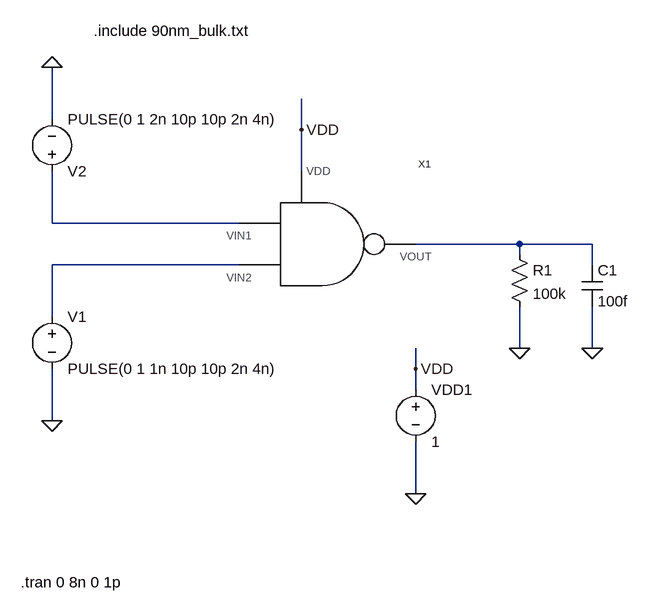
[diagram p0: schematic NAND_tb.asc]
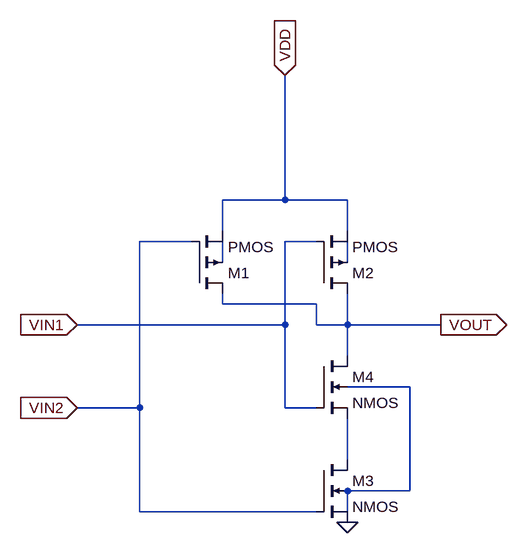
[diagram p1: sub-circuit nand.asc]
NAND_tb.asc, the LTspice schematic file:
Version 4
SHEET 1 880 680
WIRE -416 -352 -416 -432
WIRE -32 -336 -32 -384
WIRE -32 -272 -32 -336
WIRE -416 -192 -416 -272
WIRE -128 -192 -416 -192
WIRE 304 -160 144 -160
WIRE 416 -160 304 -160
WIRE 304 -144 304 -160
WIRE -128 -128 -416 -128
WIRE 416 -128 416 -160
WIRE -416 -48 -416 -128
WIRE 304 0 304 -64
WIRE 416 0 416 -64
WIRE 144 32 144 0
WIRE 144 64 144 32
WIRE -416 112 -416 32
WIRE 144 224 144 144
FLAG 144 224 0
FLAG 144 32 VDD
FLAG 304 0 0
FLAG 416 0 0
FLAG -32 -336 VDD
FLAG -416 112 0
FLAG -416 -432 0
SYMBOL voltage -416 -64 R0
WINDOW 123 0 0 Left 0
WINDOW 39 0 0 Left 0
SYMATTR InstName V1
SYMATTR Value PULSE(0 1 1n 10p 10p 2n 4n)
SYMBOL res 288 -160 R0
SYMATTR InstName R1
SYMATTR Value 100k
SYMBOL cap 400 -128 R0
SYMATTR InstName C1
SYMATTR Value 100f
SYMBOL voltage 144 48 R0
WINDOW 123 0 0 Left 0
WINDOW 39 0 0 Left 0
SYMATTR InstName VDD1
SYMATTR Value 1
SYMBOL NAND -16 -160 R0
SYMATTR InstName X1
SYMBOL voltage -416 -256 M180
WINDOW 123 0 0 Left 0
WINDOW 39 0 0 Left 0
SYMATTR InstName V2
SYMATTR Value PULSE(0 1 2n 10p 10p 2n 4n)
TEXT -352 -488 Left 2 !.include 90nm_bulk.txt
TEXT -464 360 Left 2 !.tran 0 8n 0 1p

nand.asc, the sub-circuit schematic file:
Version 4
SHEET 1 880 680
WIRE 32 -64 32 -256
WIRE 32 -64 -64 -64
WIRE 128 -64 32 -64
WIRE -64 -16 -64 -64
WIRE 128 -16 128 -64
WIRE -112 0 -192 0
WIRE 80 0 32 0
WIRE -64 32 -64 0
WIRE 128 32 128 0
WIRE -64 96 -64 80
WIRE 80 96 -64 96
WIRE 32 128 32 0
WIRE 32 128 -288 128
WIRE 80 128 80 96
WIRE 128 128 128 80
WIRE 128 128 80 128
WIRE 272 128 128 128
WIRE 128 176 128 128
WIRE 224 224 128 224
WIRE -192 256 -192 0
WIRE -192 256 -288 256
WIRE 32 256 32 128
WIRE 80 256 32 256
WIRE 128 336 128 272
WIRE 224 384 224 224
WIRE 224 384 128 384
WIRE -192 416 -192 256
WIRE 80 416 -192 416
WIRE 128 416 128 384
FLAG 128 432 0
FLAG -288 128 VIN1
IOPIN -288 128 In
FLAG -288 256 VIN2
IOPIN -288 256 In
FLAG 32 -256 VDD
IOPIN 32 -256 In
FLAG 272 128 VOUT
IOPIN 272 128 Out
SYMBOL pmos4 -112 80 M180
SYMATTR InstName M1
SYMATTR Value2 l=90n w=400n
SYMBOL pmos4 80 80 M180
SYMATTR InstName M2
SYMATTR Value2 l=90n w=400n
SYMBOL nmos4 80 336 R0
SYMATTR InstName M3
SYMATTR Value2 l=90n w=200n
SYMBOL nmos4 80 176 R0
SYMATTR InstName M4
SYMATTR Value2 l=90n w=200n

The netlist it stands for:
* NAND_tb.asc
V1 N003 0 PULSE(0 1 1n 10p 10p 2n 4n)
R1 N002 0 100k
C1 N002 0 100f
VDD1 VDD 0 1
XX1 VDD N001 N002 N003 nand
V2 N001 0 PULSE(0 1 2n 10p 10p 2n 4n)

* block symbol definitions
.subckt nand VDD VIN1 VOUT VIN2
M1 VOUT VIN2 VDD N001 PMOS l=90n w=400n
M2 VOUT VIN1 VDD N002 PMOS l=90n w=400n
M3 N004 VIN2 0 N003 NMOS l=90n w=200n
M4 VOUT VIN1 N004 N003 NMOS l=90n w=200n
.ends nand

.model NMOS NMOS
.model PMOS PMOS
.lib standard.mos
.include 90nm_bulk.txt
.tran 0 8n 0 1p
.backanno
.end